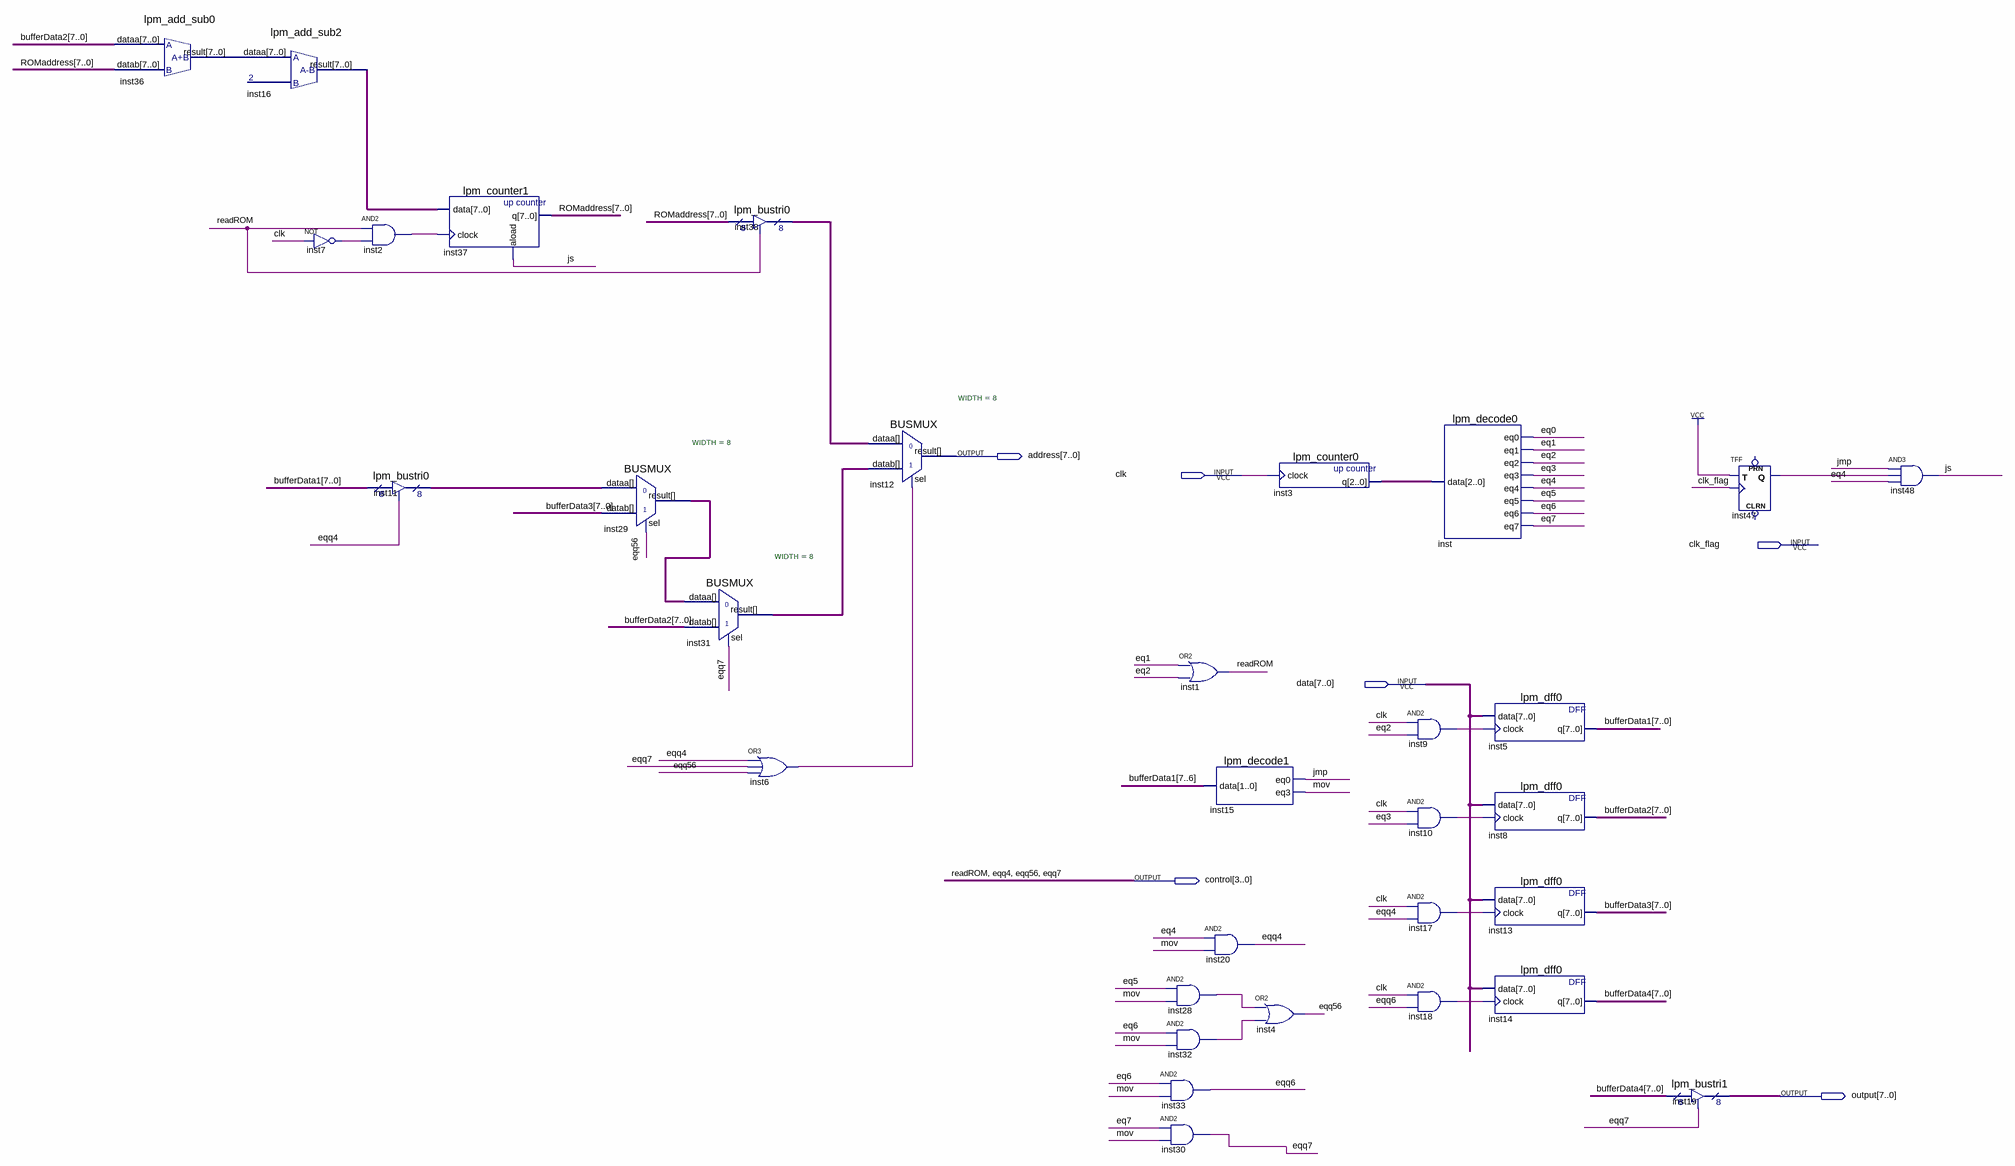
[diagram p0: schematic sheet]
// Quartus schematic device_control.bdf as structural Verilog: 32 symbols, 6 pins
module device_control (
  input  clk,
  input  clk_flag,
  input  [7:0] data,
  output [7:0] address,
  output [3:0] control,
  output [7:0] \output 
);

  wire eq0, eq1, eq2, eq3, eq4, eq5, eq6, eq7, eqq6, inst2_out, inst6_out, inst7_out, inst9_out, inst10_out,
       inst17_out, inst18_out, inst28_out, inst32_out, inst47_q, jmp, js, mov;
  wire [2:0] inst3_q;
  wire [7:0] bufferData1, bufferData2, bufferData3, bufferData4, inst11_tridata, inst16_result,
       inst29_result, inst31_result, inst36_result, inst38_tridata, ROMaddress;

  lpm_add_sub0 inst36 (.dataa(bufferData2), .datab(ROMaddress), .result(inst36_result));
  lpm_add_sub2 inst16 (.dataa(inst36_result), .result(inst16_result));
  not inst7 (inst7_out, clk);
  and inst2 (inst2_out, control[3], inst7_out);
  lpm_bustri0 inst11 (.enabledt(control[2]), .data(bufferData1), .tridata(inst11_tridata));
  lpm_counter1 inst37 (.data(inst16_result), .clock(inst2_out), .aload(js), .q(ROMaddress));
  BUSMUX #(.WIDTH(8)) inst29 (.datab(bufferData3), .sel(control[1]), .dataa(inst11_tridata), .result(inst29_result));
  lpm_bustri0 inst38 (.enabledt(control[3]), .data(ROMaddress), .tridata(inst38_tridata));
  BUSMUX #(.WIDTH(8)) inst31 (.datab(bufferData2), .sel(control[0]), .dataa(inst29_result), .result(inst31_result));
  or inst6 (inst6_out, control[2], control[0], control[1]);
  BUSMUX #(.WIDTH(8)) inst12 (.datab(inst31_result), .sel(inst6_out), .dataa(inst38_tridata), .result(address));
  or inst1 (control[3], eq1, eq2);
  and inst28 (inst28_out, eq5, mov);
  and inst32 (inst32_out, eq6, mov);
  and inst33 (eqq6, eq6, mov);
  and inst30 (control[0], eq7, mov);
  lpm_decode1 inst15 (.data(bufferData1[7:6]), .eq0(jmp), .eq3(mov));
  and inst20 (control[2], eq4, mov);
  lpm_counter0 inst3 (.clock(clk), .q(inst3_q));
  or inst4 (control[1], inst28_out, inst32_out);
  lpm_decode0 inst (
    .data(inst3_q), .eq0(eq0), .eq1(eq1), .eq2(eq2), .eq3(eq3), .eq4(eq4), .eq5(eq5), .eq6(eq6), .eq7(eq7));
  and inst9 (inst9_out, clk, eq2);
  and inst10 (inst10_out, clk, eq3);
  and inst17 (inst17_out, clk, control[2]);
  and inst18 (inst18_out, clk, eqq6);
  lpm_dff0 inst5 (.data(data), .clock(inst9_out), .q(bufferData1));
  lpm_dff0 inst8 (.data(data), .clock(inst10_out), .q(bufferData2));
  lpm_dff0 inst13 (.data(data), .clock(inst17_out), .q(bufferData3));
  lpm_dff0 inst14 (.data(data), .clock(inst18_out), .q(bufferData4));
  lpm_bustri1 inst19 (.enabledt(control[0]), .data(bufferData4), .tridata(\output ));
  TFF inst47 (.T(1'b1), .CLK(clk_flag), .Q(inst47_q));  // open: PRN, CLRN
  and inst48 (js, jmp, inst47_q, eq4);

  // Other names for the same wires on the sheet: eqq4 = control[2]; eqq7 = control[0]; eqq56 = control[1];
  //   readROM = control[3]
endmodule
